# Altium schematic sheet 正交解码.SchDoc
size A4
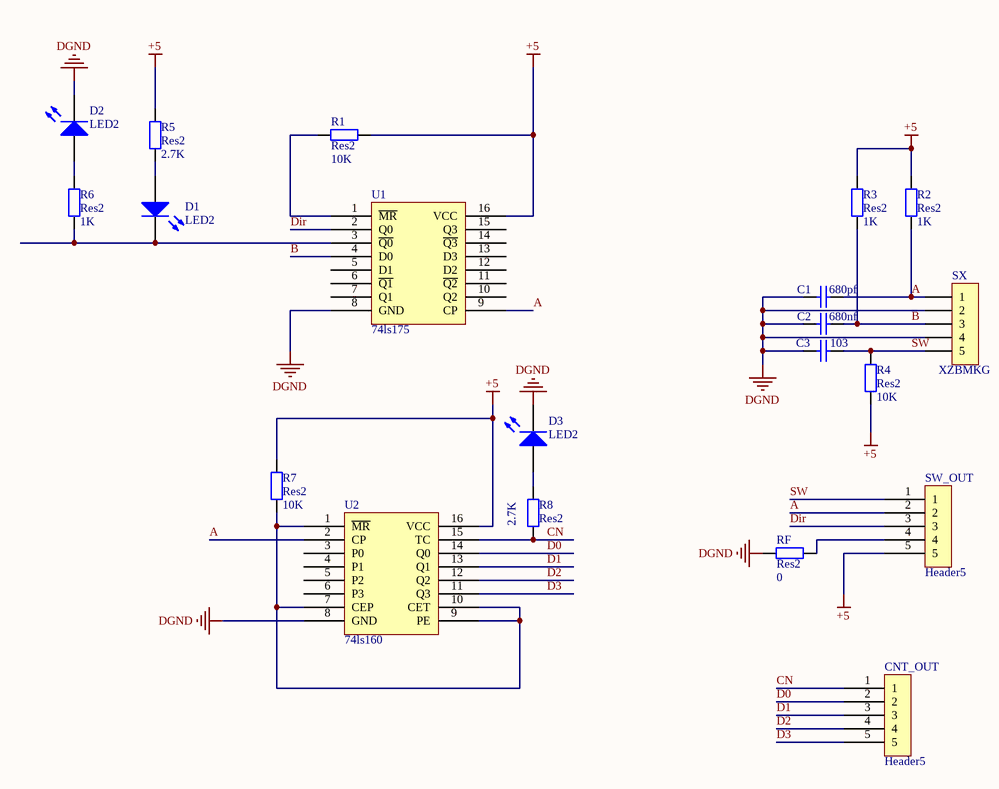
[diagram p0: 正交解码.SchDoc]

## Parts
C1  value 680pf  [0805C]  (hidden comment: 104)
C2  value 680nf  [0805C]  (hidden comment: 104)
C3  value 103  [0805C]  (hidden comment: 104)
CNT_OUT  Header5  [HDR1X5]
D1  LED2  [LED_0805]
D2  LED2  [LED_0805]
D3  LED2  [LED_0805]
R1  Res2  value 10K  [0805]
R2  Res2  value 1K  [0805]
R3  Res2  value 1K  [0805]
R4  Res2  value 10K  [0805]
R5  Res2  value 2.7K  [0805]
R6  Res2  value 1K  [0805]
R7  Res2  value 10K  [0805]
R8  Res2  value 2.7K  [0805]
RF  Res2  value 0  [0805]
SW_OUT  Header5  [HDR1X5]
SX  XZBMKG  [EC11]
U1  74ls175  [DIP16]
U2  74ls160  [DIP16]

## Nets
+5: R1.1 R2.1 R3.1 R4.2 R5.2 R7.1 SW_OUT.5 U1.16(VCC) U2.16(VCC)
DGND: C1.1 C2.1 C3.1 D2.2(K) D3.2(K) RF.1 SX.2 SX.4 U1.8(GND) U2.8(GND)
A: C1.2 R2.2 SW_OUT.2 SX.1 U1.9(CP) U2.2(CP)
B: C2.2 R3.2 SX.3 U1.4(D0)
CN: CNT_OUT.1 R8.2 U2.15(TC)
D0: CNT_OUT.2 U2.14(Q0)
D1: CNT_OUT.3 U2.13(Q1)
D2: CNT_OUT.4 U2.12(Q2)
D3: CNT_OUT.5 U2.11(Q3)
Dir: SW_OUT.3 U1.2(Q0)
SW: C3.2 R4.1 SW_OUT.1 SX.5
NetD1_1: D1.1(A) R5.1
NetD1_2: D1.2(K) R6.2 U1.3(~{Q0})
NetD2_1: D2.1(A) R6.1
NetD3_1: D3.1(A) R8.1
NetR1_2: R1.2 U1.1(~{MR})
NetR7_2: R7.2 U2.1(~{MR}) U2.7(CEP) U2.9(PE) U2.10(CET)
NetRF_2: RF.2 SW_OUT.4

Not connected (* = marked no-connect by the designer): U1 5(D1) 6(~{Q1}) 7(Q1) 10(Q2) 11(~{Q2}) 12(D2) 13(D3) 14(~{Q3}) 15(Q3); U2 3(P0) 4(P1) 5(P2) 6(P3)

## Library data of the parts
C1-C3 = Cap: Capacitor; Published: 8-Jun-2000; LatestRevisionDate: 17-Jul-2002; LatestRevisionNote: Re-released for DXP Platform.; PackageReference: RAD-0.3; Publisher: Altium Limited; PackageDescription: Radial Cap, Thru-Hole; 2 Leads; 0.3 in Pin Spacing
D1-D3 = LED2: Typical RED, GREEN, YELLOW, AMBER GaAs LED; Published: 8-Jun-2000; LatestRevisionDate: 17-Jul-2002; LatestRevisionNote: Re-released for DXP Platform.; PackageVersion: Feb-2002; PackageReference: 3.2X1.6X1.1; Publisher: Altium Limited; PackageDescription: SM LED; 2 Flat Leads
R1-R8 RF = Res2: Resistor; Published: 8-Jun-2000; LatestRevisionDate: 17-Jul-2002; LatestRevisionNote: Re-released for DXP Platform.; PackageReference: AXIAL-0.4; Publisher: Altium Limited; PackageDescription: Axial Device, Thru-Hole; 2 Leads; 0.4 in Pin Spacing
SX = CON5: Connector
U1 = 74ls165